# Altium project shkb_lite_mini_bt.PrjPcb
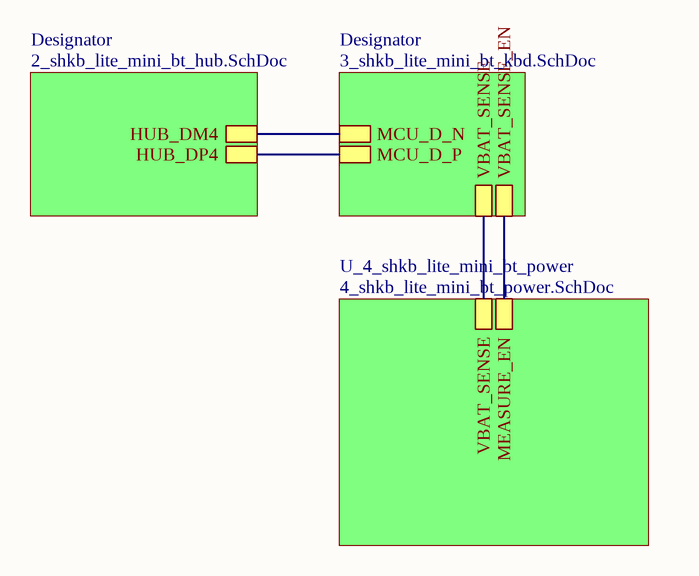
[diagram p0: 1_shkb_lite_mini_bt_top.SchDoc]
Revision: A1; ProjectTitle: SHKB Lite Mini BT
4 sheets, 80 parts. Net scope: hierarchical (ports join the sheet entries above them; power ports are global).
Board file: shkb_lite_mini_bt.PcbDoc
Sheets:
  1_shkb_lite_mini_bt_top.SchDoc
    Designator = 2_shkb_lite_mini_bt_hub.SchDoc
    Designator = 3_shkb_lite_mini_bt_kbd.SchDoc
    U_4_shkb_lite_mini_bt_power = 4_shkb_lite_mini_bt_power.SchDoc

## Sheet 1_shkb_lite_mini_bt_top.SchDoc: =ProjectTitle
size A4; Address1: github.com/4pplet/SHKB; Address2: Licence: CERN-OHL-S; Revision: A1; SheetNumber: 1; SheetTotal: 3

### Sub-sheets
Designator = 2_shkb_lite_mini_bt_hub.SchDoc: HUB_DM4, HUB_DP4
Designator = 3_shkb_lite_mini_bt_kbd.SchDoc: MCU_D_P, MCU_D_N, VBAT_SENSE, VBAT_SENSE_EN
U_4_shkb_lite_mini_bt_power = 4_shkb_lite_mini_bt_power.SchDoc: MEASURE_EN, VBAT_SENSE

### Nets
D4_N: sheet Designator/HUB_DM4, sheet Designator/MCU_D_N
D4_P: sheet Designator/HUB_DP4, sheet Designator/MCU_D_P
P0.02: sheet Designator/VBAT_SENSE_EN, sheet U_4_shkb_lite_mini_bt_power/MEASURE_EN
P0.03: sheet Designator/VBAT_SENSE, sheet U_4_shkb_lite_mini_bt_power/VBAT_SENSE

### Notes on the sheet
- Title
- Size:
- Date:
- A4
- Number:
- Time:
- Revision:
- Sheet
- of
- File:

## Sheet 2_shkb_lite_mini_bt_hub.SchDoc: =ProjectTitle
size A4; Address1: github.com/4pplet/SHKB; Address2: Licence: CERN-OHL-S; Revision: A1; SheetNumber: 2; SheetTotal: 7
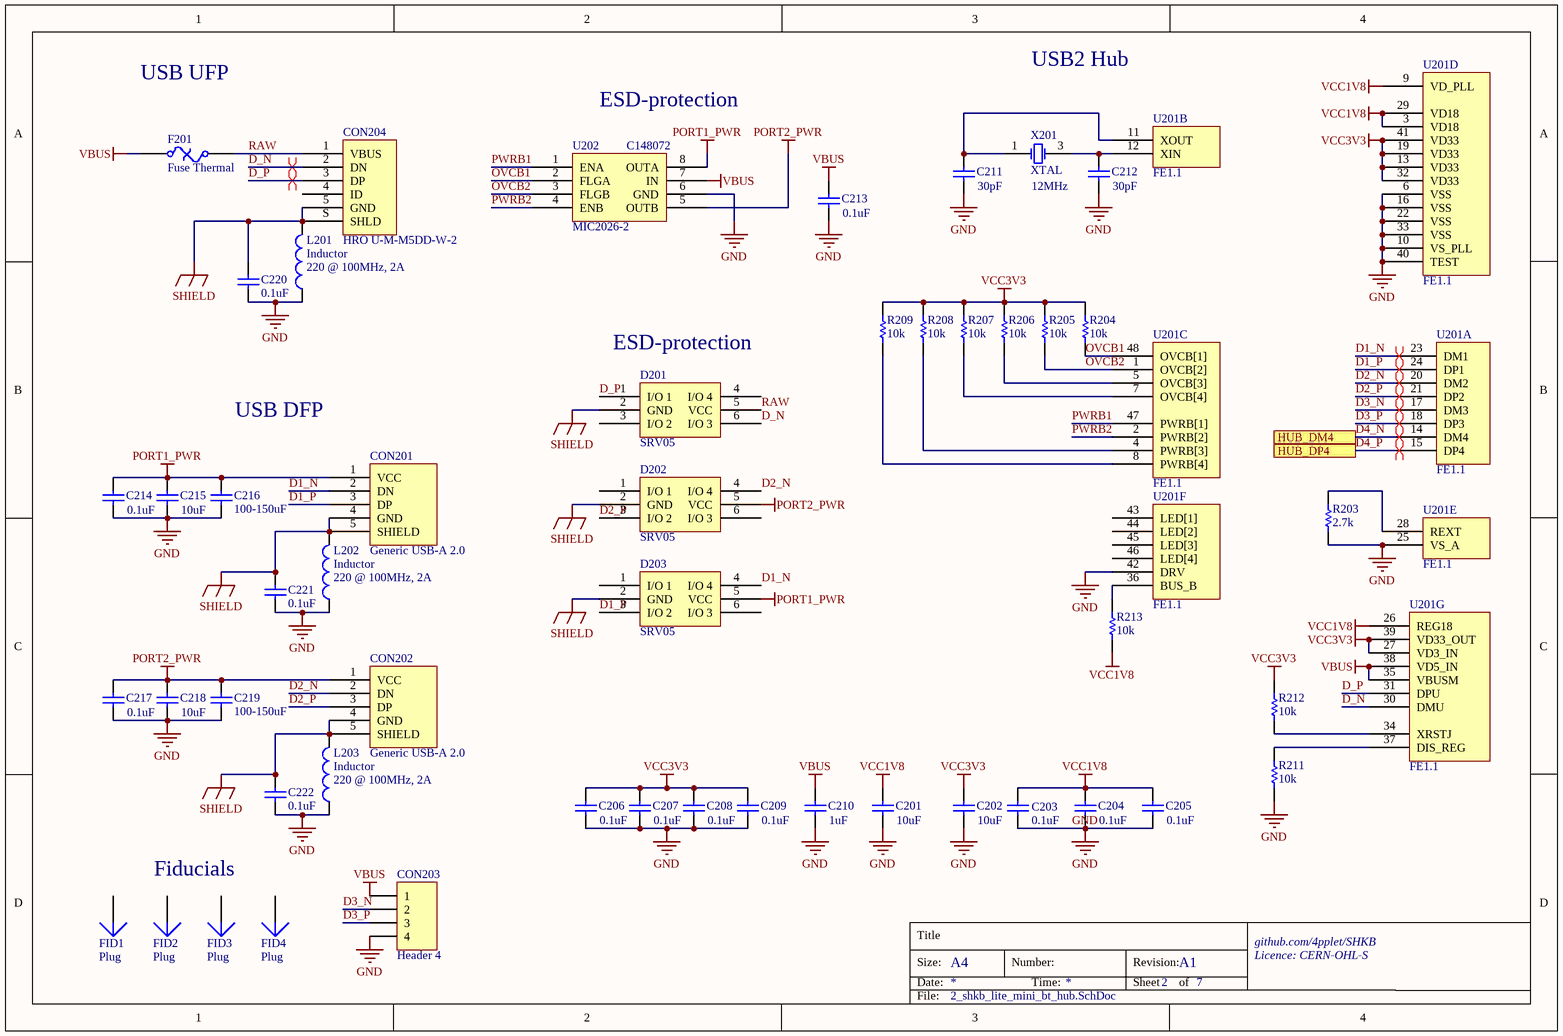
[diagram p1: 2_shkb_lite_mini_bt_hub.SchDoc]

### Parts
C201  value 10uF  [C0603[1608]]
C202  value 10uF  [C0603[1608]]
C203  value 0.1uF  [C0603[1608]]
C204  value 0.1uF  [C0603[1608]]
C205  value 0.1uF  [C0603[1608]]
C206  value 0.1uF  [C0603[1608]]
C207  value 0.1uF  [C0603[1608]]
C208  value 0.1uF  [C0603[1608]]
C209  value 0.1uF  [C0603[1608]]
C210  value 1uF  [C0603[1608]]
C211  value 30pF  [C0603[1608]]
C212  value 30pF  [C0603[1608]]
C213  value 0.1uF  [C0603[1608]]
C214  value 0.1uF  [C0603[1608]]
C215  value 10uF  [C0603[1608]]
C216  value 100-150uF  [C_9L_9M + THT]
C217  value 0.1uF  [C0603[1608]]
C218  value 10uF  [C0603[1608]]
C219  value 100-150uF  [C_9L_9M + THT]
C220  value 0.1uF  [C0603[1608]]
C221  value 0.1uF  [C0603[1608]]
C222  value 0.1uF  [C0603[1608]]
CON201  Generic USB-A 2.0  [Jing 903-231A2031S10100]
CON202  Generic USB-A 2.0  [Jing 903-231A2031S10100]
CON203  Header 4  [HDR1X4]  (no BOM)
CON204  HRO U-M-M5DD-W-2  [HRO U-M-M5DD-W-2]
D201  SRV05  [SOT-23-6]
D202  SRV05  [SOT-23-6]
D203  SRV05  [SOT-23-6]
F201  Fuse Thermal  [C1206[3216]]
FID1  Plug  [Fiducial_Nordic]  (no BOM)
FID2  Plug  [Fiducial_Nordic]  (no BOM)
FID3  Plug  [Fiducial_Nordic]  (no BOM)
FID4  Plug  [Fiducial_Nordic]  (no BOM)
L201  Inductor  value 220 @ 100MHz, 2A  [L0603[1608]]
L202  Inductor  value 220 @ 100MHz, 2A  [L0603[1608]]
L203  Inductor  value 220 @ 100MHz, 2A  [L0603[1608]]
R203  value 2.7k  [R0603[1608]]
R204  value 10k  [R0603[1608]]
R205  value 10k  [R0603[1608]]
R206  value 10k  [R0603[1608]]
R207  value 10k  [R0603[1608]]
R208  value 10k  [R0603[1608]]
R209  value 10k  [R0603[1608]]
R211  value 10k  [R0603[1608]]
R212  value 10k  [R0603[1608]]
R213  value 10k  [R0603[1608]]
U201  FE1.1  [FE1.1 LQFP48]  (parts A,B,C,D,E,F,G of 7)
U202  MIC2026-2  [SOIC-8]
X201  XTAL  value 12MHz  [XTAL-3225]

### Ports
HUB_DM4, HUB_DP4

### Nets
GND: C201.1 C202.1 C203.1 C204.1 C205.1 C206.1 C207.1 C208.1 C209.1 C210.1 C211.1 C212.1 C213.1 C214.1 C215.1 C216.2 C217.1 C218.1 C219.2 C220.1 C221.1 C222.1 CON203.4 L201.1 L202.1 L203.1 R203.1 R211.1 U201.6(VSS) U201.10(VS_PLL) U201.16(VSS) U201.22(VSS) U201.25(VS_A) U201.33(VSS) U201.40(TEST) U201.42(DRV) U202.6(GND) X201.2(GND) X201.4(GND)
PORT1_PWR: C214.2 C215.2 C216.1 CON201.1(VCC) D203.5(VCC) U202.8(OUTA)
PORT2_PWR: C217.2 C218.2 C219.1 CON202.1(VCC) D202.5(VCC) U202.5(OUTB)
SHIELD: C220.2 C221.2 C222.2 CON201.4(GND) CON201.5(SHIELD) CON202.4(GND) CON202.5(SHIELD) CON204.5(GND) CON204.S(SHLD) D201.2(GND) D202.2(GND) D203.2(GND) L201.2 L202.2 L203.2
VBUS: C210.2 C213.2 CON203.1 F201.1 U201.35(VBUSM) U201.38(VD5_IN) U202.7(IN)
VCC1V8: C201.2 C203.2 C204.2 C205.2 R213.1 U201.3(VD18) U201.9(VD_PLL) U201.26(REG18) U201.29(VD18)
VCC3V3: C202.2 C206.2 C207.2 C208.2 C209.2 R204.2 R205.2 R206.2 R207.2 R208.2 R209.2 R212.2 U201.13(VD33) U201.19(VD33) U201.27(VD3_IN) U201.32(VD33) U201.39(VD33_OUT) U201.41(VD33)
D1_N: CON201.2(DN) D203.4(I/O_4) U201.23(DM1)
D1_P: CON201.3(DP) D203.3(I/O_2) U201.24(DP1)
D2_N: CON202.2(DN) D202.4(I/O_4) U201.20(DM2)
D2_P: CON202.3(DP) D202.3(I/O_2) U201.21(DP2)
D3_N: CON203.2 U201.17(DM3)
D3_P: CON203.3 U201.18(DP3)
D4_N: U201.14(DM4) ; port HUB_DM4
D4_P: U201.15(DP4) ; port HUB_DP4
D_N: CON204.2(DN) D201.6(I/O_3) U201.30(DMU)
D_P: CON204.3(DP) D201.1(I/O_1) U201.31(DPU)
OVCB1: R204.1 U201.48(OVCB[1]) U202.2(FLGA)
OVCB2: R205.1 U201.1(OVCB[2]) U202.3(FLGB)
PWRB1: U201.47(PWRB[1]) U202.1(ENA)
PWRB2: U201.2(PWRB[2]) U202.4(ENB)
RAW: CON204.1(VBUS) D201.5(VCC) F201.2
NetC211_2: C211.2 U201.11(XOUT) X201.1(OSC1)
NetC212_2: C212.2 U201.12(XIN) X201.3(OSC2)
NetR203_2: R203.2 U201.28(REXT)
NetR206_1: R206.1 U201.5(OVCB[3])
NetR207_1: R207.1 U201.7(OVCB[4])
NetR208_1: R208.1 U201.4(PWRB[3])
NetR209_1: R209.1 U201.8(PWRB[4])
NetR211_2: R211.2 U201.37(DIS_REG)
NetR212_1: R212.1 U201.34(XRSTJ)
NetR213_2: R213.2 U201.36(BUS_B)

Not connected (* = marked no-connect by the designer): CON204 4(ID); D201 3(I/O_2) 4(I/O_4); D202 1(I/O_1) 6(I/O_3); D203 1(I/O_1) 6(I/O_3); FID1 1; FID2 1; FID3 1; FID4 1; U201 43(LED[1]) 44(LED[2]) 45(LED[3]) 46(LED[4])

### Layout directives
differential pair: D1_N, D1_P, D2_N, D2_P, D3_N, D3_P, D4_N, D4_P, D_N, D_P

### Notes on the sheet
- USB UFP
- ESD-protection
- USB2 Hub
- (near U202) C148072
- (near D201) ESD-protection
- USB DFP
- Fiducials
- Title
- Size:
- Date:
- A4
- Number:
- Time:
- Revision:
- Sheet
- of
- File:

### Library data of the parts
C201 C202 C215 C218 = Cap: Capacitor; MRF.Part: CL10A106KP8NNNC; LCSC MFG: Samsung Electro-Mechanics; Version: 0603 imperial; LCSC Part #: C19702
C203-C209 C213 C214 C217 C220-C222 = Cap: Capacitor; MRF.Part: CC0603KRX7R9BB104; MFG: KEMET; MFGPN: C0603C104M5RACTU; LCSC MFG: YAGEO; Version: 0603 imperial; LCSC Part #: C14663
C210 = Cap: Capacitor; MRF.Part: CL10A105KB8NNNC; MFG: KEMET; MFGPN: C0603C105K4RACTU; LCSC MFG: Samsung Electro-Mechanics; Version: 0603 imperial; LCSC Part #: C15849
C211 C212 = Cap: Capacitor; MRF.Part: CL10C300JB8NNNC; LCSC MFG: Samsung Electro-Mechanics; Version: 0603 imperial; LCSC Part #: C22397
C216 C219 = Cap: Capacitor; MRF.Part: OVZ101M1CTR-0606; LCSC MFG: Lelon; Version: SMD - 9L or 9M; LCSC Part #: C134878
CON201 CON202 = Generic USB-A 2.0: MRF.Part: 903-231A2031S10100; LCSC MFG: Jing Extension of the Electronic Co.; LCSC Part #: C42646
CON203 = Header 4: Header, 4-Pin
CON204 = HRO U-M-M5DD-W-2: LCSC MFG: Korean Hroparts Elec; LCSC Part #: C879746; MRF.Part: U-M-M5DD-W-2
D201-D203 = SRV05: MRF.Part: SRV05-4-P-T7; LCSC MFG: ProTek Devices; LCSC Part #: C85364
F201 = Fuse Thermal: Thermal Fuse; MRF.Part: ASMD1206-050; MFG: Bel Fuse Inc.; MFGPN: 0ZCJ0050FF2G; LCSC MFG: Shenzhen JDT Fuse; LCSC Part #: C135338
L201-L203 = Inductor: MRF.Part: BLM18KG331SN1D; MFG: Murata Electronics North America; MFGPN: BLM18KG221SN1D; LCSC MFG: Murata Electronics; Version: 0603 imperial; LCSC Part #: C85832
R203 = Res1: Resistor; MRF.Part: 0603WAF2701T5E; LCSC MFG: UNI-ROYAL(Uniroyal Elec); Version: 0603 imperial; LCSC Part #: C13167
R204-R209 R211-R213 = Res1: Resistor; MRF.Part: 0603WAF1002T5E; MFG: Vishay Dale; MFGPN: RCA060310K0FKEA; LCSC MFG: Uniroyal Elec; Version: 0603 imperial; LCSC Part #: C25804
U201 = FE1.1: LCSC MFG: Terminus Tech; LCSC Part #: C28958; MRF.Part: FE1.1
U202 = MIC2026-2: MRF.Part: MIC2026-2YM-TR; LCSC MFG: Microchip Tech; LCSC Part #: C148072
X201 = XTAL: Crystal Oscillator; MRF.Part: X322512MSB4SI; LCSC MFG: Yangxing Tech; LCSC Part #: C9002

## Sheet 3_shkb_lite_mini_bt_kbd.SchDoc: =ProjectTitle
size A4; Address1: github.com/4pplet/cyber60; Address2: Licence: CERN-OHL-S; Revision: A1; SheetNumber: 3; SheetTotal: 5
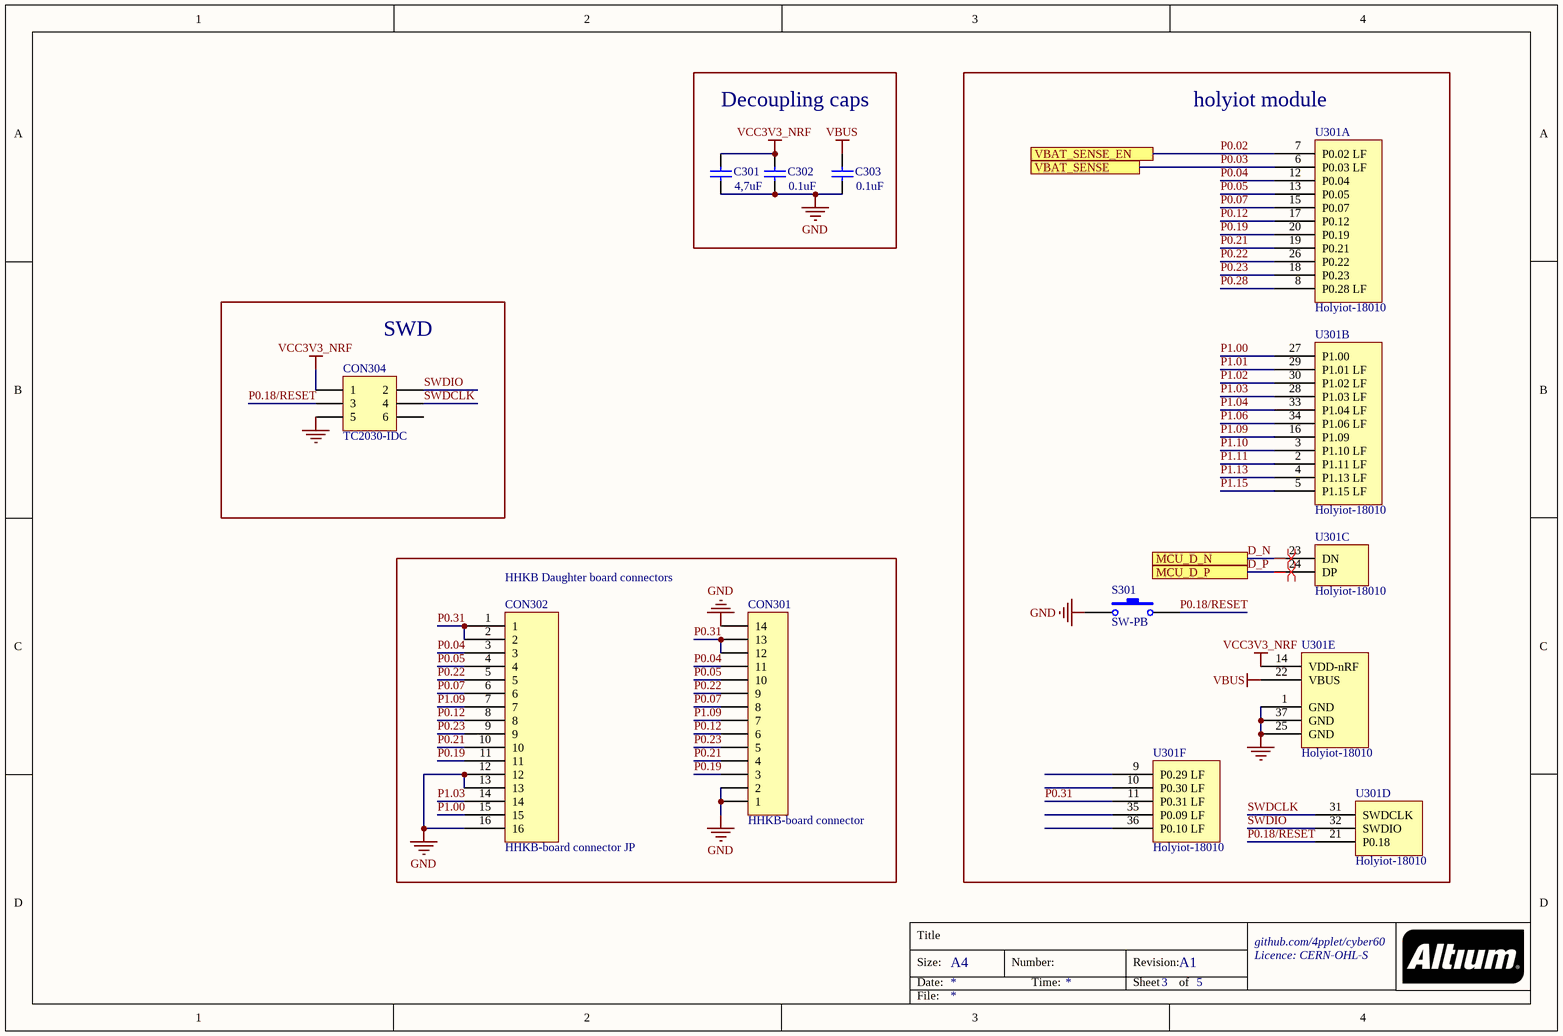
[diagram p2: 3_shkb_lite_mini_bt_kbd.SchDoc]

### Parts
C301  value 4,7uF  [C0603[1608]]
C302  value 0.1uF  [C0603[1608]]
C303  value 0.1uF  [C0603[1608]]
CON301  HHKB-board connector  [JST S13B-ZR-SM4A-TF(LF)(SN)]
CON302  HHKB-board connector JP  [DF14A-15P-1.25H]  (no BOM)
CON304  TC2030-IDC  [TC2030-IDC-NL]  (no BOM)
S301  SW-PB  [Wurth 431256038736]
U301  Holyiot-18010  [Holyiot-18010 - outer pads]  (parts A,B,C,D,E,F of 6)

### Blocks framed on the sheet
Decoupling caps: C301-C303
holyiot module: S301 U301
SWD: CON304
HHKB Daughter board connectors: CON301 CON302

### Ports
MCU_D_N, MCU_D_P, VBAT_SENSE, VBAT_SENSE_EN

### Nets
GND: C301.1 C302.1 C303.1 CON301.1 CON301.2 CON301.14 CON302.12 CON302.13 CON302.16 CON304.5 S301.2 S301.3(GND) U301.1(GND) U301.25(GND) U301.37(GND)
VBUS: C303.2 U301.22(VBUS)
VCC3V3_NRF: C301.2 C302.2 CON304.1 U301.14(VDD-nRF)
D_N: U301.23(DN) ; port MCU_D_N  [project net D4_N]
D_P: U301.24(DP) ; port MCU_D_P  [project net D4_P]
P0.02: U301.7(P0.02_LF) ; port VBAT_SENSE_EN
P0.03: U301.6(P0.03_LF) ; port VBAT_SENSE
P0.04: CON301.11 CON302.3 U301.12(P0.04)
P0.05: CON301.10 CON302.4 U301.13(P0.05)
P0.07: CON301.8 CON302.6 U301.15(P0.07)
P0.12: CON301.6 CON302.8 U301.17(P0.12)
P0.18/RESET: CON304.3 S301.1 U301.21(P0.18)
P0.19: CON301.3 CON302.11 U301.20(P0.19)
P0.21: CON301.4 CON302.10 U301.19(P0.21)
P0.22: CON301.9 CON302.5 U301.26(P0.22)
P0.23: CON301.5 CON302.9 U301.18(P0.23)
P0.28: U301.8(P0.28_LF)
P0.31: CON301.12 CON301.13 CON302.1 CON302.2 U301.11(P0.31_LF)
P1.00: CON302.15 U301.27(P1.00)
P1.01: U301.29(P1.01_LF)
P1.02: U301.30(P1.02_LF)
P1.03: CON302.14 U301.28(P1.03_LF)
P1.04: U301.33(P1.04_LF)
P1.06: U301.34(P1.06_LF)
P1.09: CON301.7 CON302.7 U301.16(P1.09)
P1.10: U301.3(P1.10_LF)
P1.11: U301.2(P1.11_LF)
P1.13: U301.4(P1.13_LF)
P1.15: U301.5(P1.15_LF)
SWDCLK: CON304.4 U301.31(SWDCLK)
SWDIO: CON304.2 U301.32(SWDIO)

Not connected (* = marked no-connect by the designer): CON304 6; U301 9(P0.29_LF) 10(P0.30_LF) 35(P0.09_LF) 36(P0.10_LF)

### Layout directives
differential pair: D4_N, D4_P

### Notes on the sheet
- Title
- Size:
- Date:
- A4
- Number:
- Time:
- Revision:
- Sheet
- of
- File:

### Library data of the parts
C301 = Cap: Capacitor; MRF.Part: CL10A475KO8NNNC; LCSC MFG: Samsung Electro-Mechanics; LCSC Part #: C19666
C302 C303 = Cap: as C203 on sheet 2_shkb_lite_mini_bt_hub; Version: 0603 imperial; LCSC Part #: C14663
CON301 = Header 14: MFGPN: S13B-ZR-SM4A-TF(LF)(SN); MFG: JST Sales America Inc; LCSC MFG: JST Sales America; LCSC Part #: C265326; MRF.Part: S13B-ZR-SM4A-TF(LF)(SN)
CON302 = DF14A-15P-1.25H: MFG: Hirose Electric Co Ltd; MFGPN: DF14A-15P-1.25H(26); LCSC MFG: HRS(Hirose); LCSC Part #: C597889; MRF.Part: DF14A-15P-1.25H(26)
CON304 = Header 3X2: Header, 3-Pin, Dual row
S301 = SW-PB: Switch; MRF.Part: K2-1102AQ-C4CW-01; MFGPN: 431256038736; MFG: Wurth Electronics Inc; LCSC MFG: Korean Hroparts Elec; LCSC Part #: C127680
U301 = Holyiot-18010: MFGPN: YJ-18010; MFG: Holyiot

## Sheet 4_shkb_lite_mini_bt_power.SchDoc: =ProjectTitle
size A4; Address1: github.com/4pplet/cyber60; Address2: Licence: CERN-OHL-S; Revision: A1; SheetNumber: 4; SheetTotal: 5; ProjectName: shkb_lite_mini_bt.PrjPcb
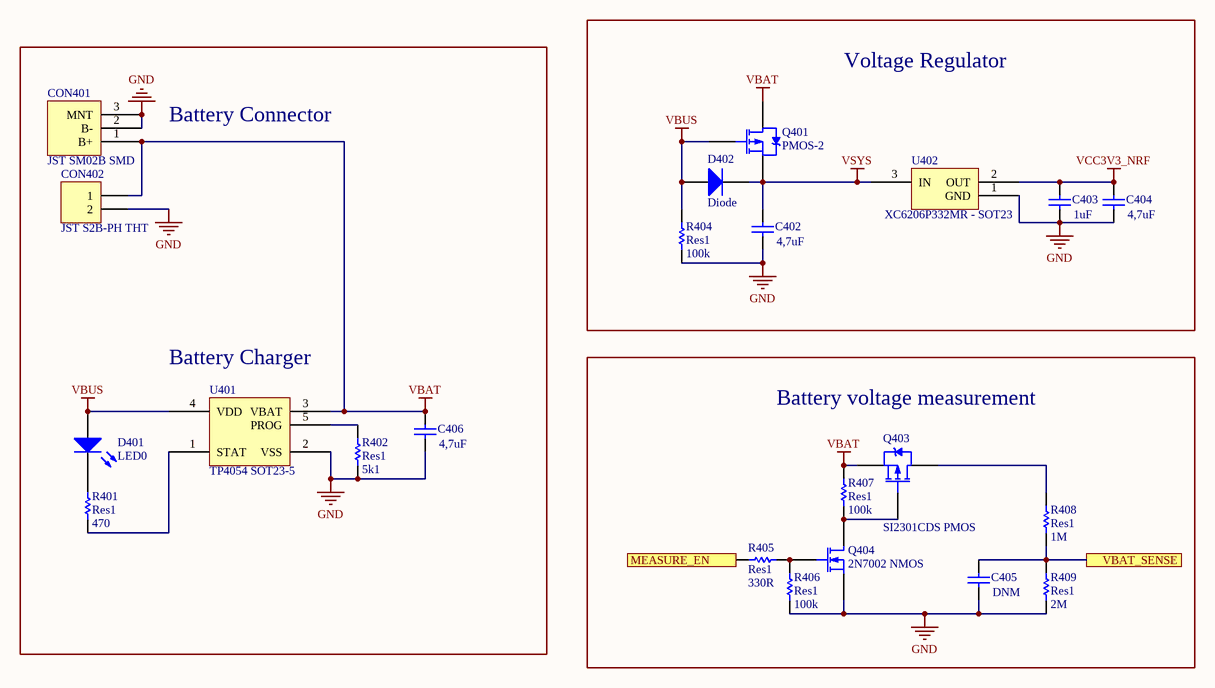
[diagram p3: 4_shkb_lite_mini_bt_power.SchDoc]

### Parts
C402  value 4,7uF  [C0603[1608]]
C403  value 1uF  [C0603[1608]]
C404  value 4,7uF  [C0603[1608]]
C405  DNM  [C0603[1608]]  (no BOM)
C406  value 4,7uF  [C0603[1608]]
CON401  JST SM02B SMD  [JST SM02B-SRSS-TB]
CON402  JST S2B-PH THT  [JST S2B-PH-K(LF)(SN)]  (no BOM)
D401  LED0  [LED0603[1608]]
D402  Diode  [SOD-123]
Q401  PMOS-2  [SOT-23-3]
Q403  SI2301CDS PMOS  [SOT-23-3]
Q404  2N7002 NMOS  [SOT-23-3]
R401  Res1  value 470  [R0603[1608]]
R402  Res1  value 5k1  [R0603[1608]]
R404  Res1  value 100k  [R0603[1608]]
R405  Res1  value 330R  [R0603[1608]]
R406  Res1  value 100k  [R0603[1608]]
R407  Res1  value 100k  [R0603[1608]]
R408  Res1  value 1M  [R0603[1608]]
R409  Res1  value 2M  [R0603[1608]]
U401  TP4054 SOT23-5  [SOT-23-5]
U402  XC6206P332MR - SOT23  [SOT-23-3]

### Blocks framed on the sheet
Voltage Regulator: C402-C404 D402 Q401 R404 U402
Battery voltage measurement: C405 Q403 Q404 R405-R409

### Ports
MEASURE_EN, VBAT_SENSE

### Nets
GND: C402.1 C403.1 C404.1 C405.1 C406.1 CON401.2(B-) CON401.3(MNT) CON402.2 Q404.2(S) R402.2 R404.2 R406.2 R409.2 U401.2(VSS) U402.1(GND)
VBAT: C406.2 CON401.1(B+) CON402.1 Q401.3(D) Q403.2(S) R407.1 U401.3(VBAT)
VBUS: D401.1(A) D402.1(A) Q401.1(G) R404.1 U401.4(VDD)
VCC3V3_NRF: C403.2 C404.2 U402.2(OUT)
VSYS: C402.2 D402.2(K) Q401.2(S) U402.3(IN)
P0.02: R405.1 ; port MEASURE_EN
P0.03: C405.2 R408.2 R409.1 ; port VBAT_SENSE
NetD401_2: D401.2(K) R401.2
NetQ403_1: Q403.1(G) Q404.3(D) R407.2
NetQ403_3: Q403.3(D) R408.1
NetQ404_1: Q404.1(G) R405.2 R406.1
NetR401_1: R401.1 U401.1(STAT)
NetR402_1: R402.1 U401.5(PROG)

### Notes on the sheet
- Battery Connector
- (near U401) Battery Charger
- Title
- Size:
- Date:
- A4
- Number:
- Time:
- Revision:
- Sheet
- of
- File:

### Library data of the parts
C402 C404 C406 = Cap: as C301 on sheet 3_shkb_lite_mini_bt_kbd; LCSC Part #: C19666
C403 = Cap: Capacitor; MRF.Part: CL10A105KB8NNNC; MFG: KEMET; MFGPN: C0603C104M5RACTU; LCSC MFG: Samsung Electro-Mechanics; Version: 0603 imperial; LCSC Part #: C15849
C405 = Cap: Capacitor; Value: DNM; Version: 0603 imperial
CON401 = JST S2B-PH-SM4-TB: MRF.Part: SM02B-SRSS-TB(LF)(SN); LCSC MFG: JST Sales America; LCSC Part #: C160402
CON402 = Header 2: Header, 2-Pin; MRF.Part: S2B-PH-K(LF)(SN); LCSC MFG: JST Sales America; LCSC Part #: C265016
D401 = LED0: Typical INFRARED GaAs LED; MRF.Part: 19-213/Y2C-CQ2R2L/3T(CY); LCSC MFG: Everlight Elec; LCSC Part #: C72038
D402 = Diode: Default Diode; MRF.Part: B5819W; LCSC MFG: Changjiang Electronics Tech (CJ); Version: SOD-123; LCSC Part #: C8598
Q401 Q403 = PMOS-2: P-Channel Power MOSFET; MRF.Part: SI2301CDS-T1-GE3; LCSC MFG: Vishay Intertech; LCSC Part #: C10487
Q404 = MOSFET-N: N-Channel MOSFET; LCSC MFG: Changjiang Electronics Tech (CJ); LCSC Part #: C8545; MRF.Part: 2N7002
R401 = Res1: Resistor; MRF.Part: 0603WAF4700T5E; MFG: Panasonic Electronic Components; MFGPN: ERJ-3EKF5101V; LCSC MFG: UNI-ROYAL(Uniroyal Elec); Version: 0603 imperial; LCSC Part #: C23179
R402 = Res1: Resistor; MRF.Part: 0603WAF5101T5E; MFG: Panasonic Electronic Components; MFGPN: ERJ-3EKF5101V; LCSC MFG: Uniroyal Elec; Version: 0603 imperial; LCSC Part #: C23186
R404 R406 R407 = Res1: Resistor; MRF.Part: 0603WAF1003T5E; LCSC MFG: Uniroyal Elec; Version: 0603 imperial; LCSC Part #: C25803
R405 = Res1: Resistor; MRF.Part: 0603WAF3300T5E; LCSC MFG: Uniroyal Elec; Version: 0603 imperial; LCSC Part #: C23138
R408 = Res1: Resistor; MRF.Part: 0603WAF1004T5E; LCSC MFG: Uniroyal Elec; Version: 0603 imperial; LCSC Part #: C22935
R409 = Res1: Resistor; MRF.Part: 0603WAF2004T5E; LCSC MFG: Uniroyal Elec; Version: 0603 imperial; LCSC Part #: C22976
U401 = MCP73831: LCSC MFG: Nanjing Extension Microelectronics; LCSC Part #: C32574; MRF.Part: TP4054
U402 = SOT23 LDO: LCSC MFG: Torex Semicon; MFG: Texas Instruments; MFGPN: TPS7A0533PDBZ; LCSC Part #: C5446; MRF.Part: XC6206P332MR

## Nets that join several sheets
GND: 2_shkb_lite_mini_bt_hub (39 pins), 3_shkb_lite_mini_bt_kbd (15 pins), 4_shkb_lite_mini_bt_power (15 pins)
VBUS: 2_shkb_lite_mini_bt_hub (7 pins), 3_shkb_lite_mini_bt_kbd (C303.2 U301.22), 4_shkb_lite_mini_bt_power (5 pins)
VCC3V3_NRF: 3_shkb_lite_mini_bt_kbd (C301.2 C302.2 CON304.1 U301.14), 4_shkb_lite_mini_bt_power (C403.2 C404.2 U402.2)
D4_N: 2_shkb_lite_mini_bt_hub (U201.14), 3_shkb_lite_mini_bt_kbd (U301.23)
D4_P: 2_shkb_lite_mini_bt_hub (U201.15), 3_shkb_lite_mini_bt_kbd (U301.24)
P0.02: 3_shkb_lite_mini_bt_kbd (U301.7), 4_shkb_lite_mini_bt_power (R405.1)
P0.03: 3_shkb_lite_mini_bt_kbd (U301.6), 4_shkb_lite_mini_bt_power (C405.2 R408.2 R409.1)